# Altium schematic sheet Extport.SchDoc
size A4
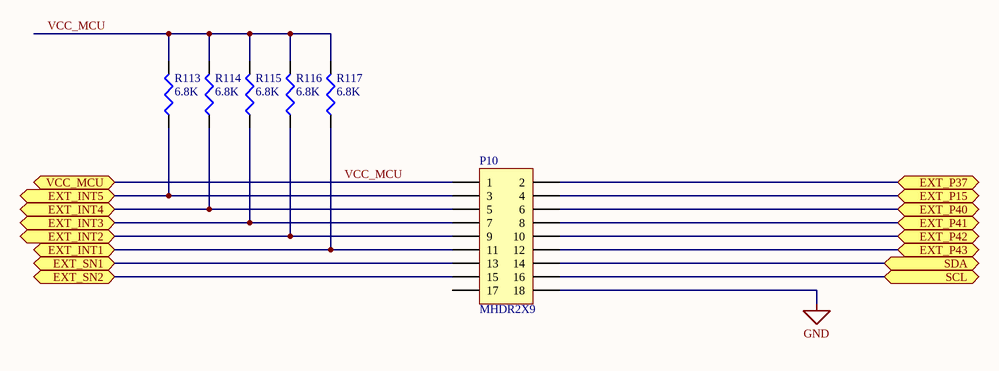
[diagram p0: Extport.SchDoc]

## Parts
P10  MHDR2X9  [MHDR2X9]
R113  value 6.8K  [0603]  (hidden comment: Res3)
R114  value 6.8K  [0603]  (hidden comment: Res3)
R115  value 6.8K  [0603]  (hidden comment: Res3)
R116  value 6.8K  [0603]  (hidden comment: Res3)
R117  value 6.8K  [0603]  (hidden comment: Res3)

## Ports
EXT_INT1 (bidir), EXT_INT2 (bidir), EXT_INT3 (bidir), EXT_INT4 (bidir), EXT_INT5 (bidir), EXT_P15 (bidir), EXT_P37 (bidir), EXT_P40 (bidir), EXT_P41 (bidir), EXT_P42 (bidir), EXT_P43 (bidir), EXT_SN1 (bidir), EXT_SN2 (bidir), SCL (bidir), SDA (bidir), VCC_MCU (bidir)

## Nets
GND: P10.18
EXT_INT1: P10.11 R117.1 ; port EXT_INT1
EXT_INT2: P10.9 R116.1 ; port EXT_INT2
EXT_INT3: P10.7 R115.1 ; port EXT_INT3
EXT_INT4: P10.5 R114.1 ; port EXT_INT4
EXT_INT5: P10.3 R113.1 ; port EXT_INT5
EXT_P15: P10.4 ; port EXT_P15
EXT_P37: P10.2 ; port EXT_P37
EXT_P40: P10.6 ; port EXT_P40
EXT_P41: P10.8 ; port EXT_P41
EXT_P42: P10.10 ; port EXT_P42
EXT_P43: P10.12 ; port EXT_P43
EXT_SN1: P10.13 ; port EXT_SN1
EXT_SN2: P10.15 ; port EXT_SN2
SCL: P10.16 ; port SCL
SDA: P10.14 ; port SDA
VCC_MCU: P10.1 R113.2 R114.2 R115.2 R116.2 R117.2 ; port VCC_MCU

Not connected (* = marked no-connect by the designer): P10 17

## Library data of the parts
P10 = MHDR2X9: Header, 9-Pin, Dual row; LatestRevisionDate: 17-Jul-2002; LatestRevisionNote: Re-released for DXP Platform.; Publisher: Altium Limited
R113-R117 = Res3: Resistor; Published: 8-Jun-2000; LatestRevisionDate: 29-May-2009; LatestRevisionNote: IPC-7351 Footprint Added.; PackageReference: J1-0603; Publisher: Altium Limited; PackageDescription: Chip Resistor